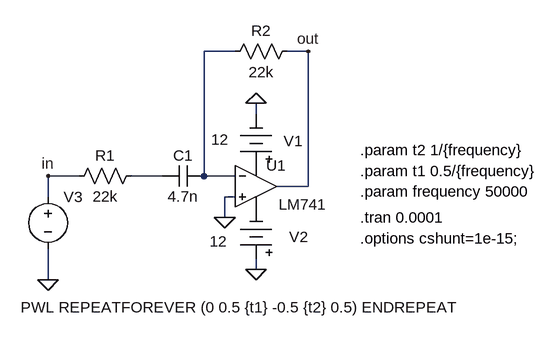
[diagram p0: schematic exp1.asc]
exp1.asc, the LTspice schematic file:
Version 4.1
SHEET 1 880 780
WIRE 112 -64 64 -64
WIRE 224 -64 192 -64
WIRE 144 32 144 16
WIRE -128 128 -176 128
WIRE 0 128 -48 128
WIRE 64 128 64 -64
WIRE 112 128 64 128
WIRE 224 144 224 -64
WIRE 224 144 176 144
WIRE -176 160 -176 128
WIRE 112 160 96 160
WIRE 96 192 96 160
WIRE 144 272 144 256
WIRE -176 288 -176 240
FLAG 144 272 0
FLAG 144 16 0
FLAG 96 192 0
FLAG -176 288 0
FLAG -176 128 in
FLAG 224 -64 out
SYMBOL OpAmps\\LM741 144 80 R0
WINDOW 3 35 92 Left 2
SYMATTR InstName U1
SYMBOL Misc\\battery 144 128 R180
WINDOW 0 -72 54 Left 2
WINDOW 3 42 56 Left 2
WINDOW 123 0 0 Left 0
WINDOW 39 0 0 Left 0
SYMATTR InstName V1
SYMATTR Value 12
SYMBOL Misc\\battery 144 272 R180
WINDOW 0 -80 50 Left 2
WINDOW 3 44 43 Left 2
WINDOW 123 0 0 Left 0
WINDOW 39 0 0 Left 0
SYMATTR InstName V2
SYMATTR Value 12
SYMBOL voltage -176 144 R0
WINDOW 3 633 186 Right 2
WINDOW 123 0 0 Left 0
WINDOW 39 0 0 Left 0
SYMATTR InstName V3
SYMATTR Value PWL REPEATFOREVER (0 0.5 {t1} -0.5 {t2} 0.5) ENDREPEAT
SYMBOL res -32 112 R90
WINDOW 0 0 56 VBottom 2
WINDOW 3 32 56 VTop 2
SYMATTR InstName R1
SYMATTR Value 22k
SYMBOL cap 64 112 R90
WINDOW 0 0 32 VBottom 2
WINDOW 3 32 32 VTop 2
SYMATTR InstName C1
SYMATTR Value 4.7n
SYMBOL res 208 -80 R90
WINDOW 0 0 56 VBottom 2
WINDOW 3 32 56 VTop 2
SYMATTR InstName R2
SYMATTR Value 22k
TEXT 304 192 Left 2 !.tran 0.0001
TEXT 304 224 Left 2 !.options cshunt=1e-15;
TEXT 304 152 Left 2 !.param frequency 50000
TEXT 304 120 Left 2 !.param t1 0.5/{frequency}
TEXT 304 88 Left 2 !.param t2 1/{frequency}

The netlist it stands for:
* exp1.asc
X§U1 0 N001 P001 P002 out LM741  ; pins In+ In- V+ V- OUT
V1 P001 0 12
V2 0 P002 12
V3 in 0 PWL REPEATFOREVER (0 0.5 {t1} -0.5 {t2} 0.5) ENDREPEAT
R1 N002 in 22k
C1 N001 N002 4.7n
R2 out N001 22k
.tran 0.0001
.options cshunt=1e-15;
.param frequency 50000
.param t1 0.5/{frequency}
.param t2 1/{frequency}
.lib LM741.lib
.backanno
.end